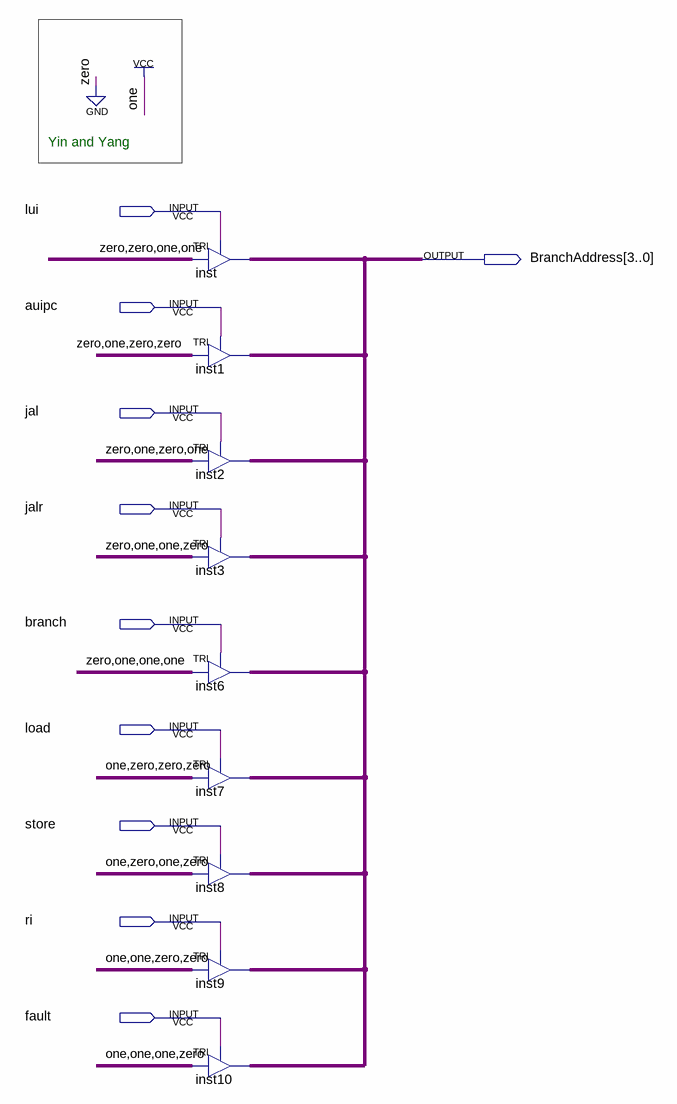
[diagram p0: schematic sheet]
// Quartus schematic ControlUnitOpSwitch.bdf as structural Verilog: 9 symbols, 10 pins
module ControlUnitOpSwitch (
  input  lui,
  input  auipc,
  input  jal,
  input  jalr,
  input  branch,
  input  load,
  input  store,
  input  ri,
  input  fault,
  output [3:0] BranchAddress
);

  TRI inst[3:0] (.IN(4'b0011), .OE(lui), .OUT(BranchAddress));
  TRI inst1[3:0] (.IN(4'b0100), .OE(auipc), .OUT(BranchAddress));
  TRI inst2[3:0] (.IN(4'b0101), .OE(jal), .OUT(BranchAddress));
  TRI inst3[3:0] (.IN(4'b0110), .OE(jalr), .OUT(BranchAddress));
  TRI inst6[3:0] (.IN(4'b0111), .OE(branch), .OUT(BranchAddress));
  TRI inst7[3:0] (.IN(4'b1000), .OE(load), .OUT(BranchAddress));
  TRI inst8[3:0] (.IN(4'b1010), .OE(store), .OUT(BranchAddress));
  TRI inst9[3:0] (.IN(4'b1100), .OE(ri), .OUT(BranchAddress));
  TRI inst10[3:0] (.IN(4'b1110), .OE(fault), .OUT(BranchAddress));

  // Notes on the sheet:
  //   Yin and Yang
endmodule
